# EAGLE design pcb_business_card (EAGLE 7.2.0)
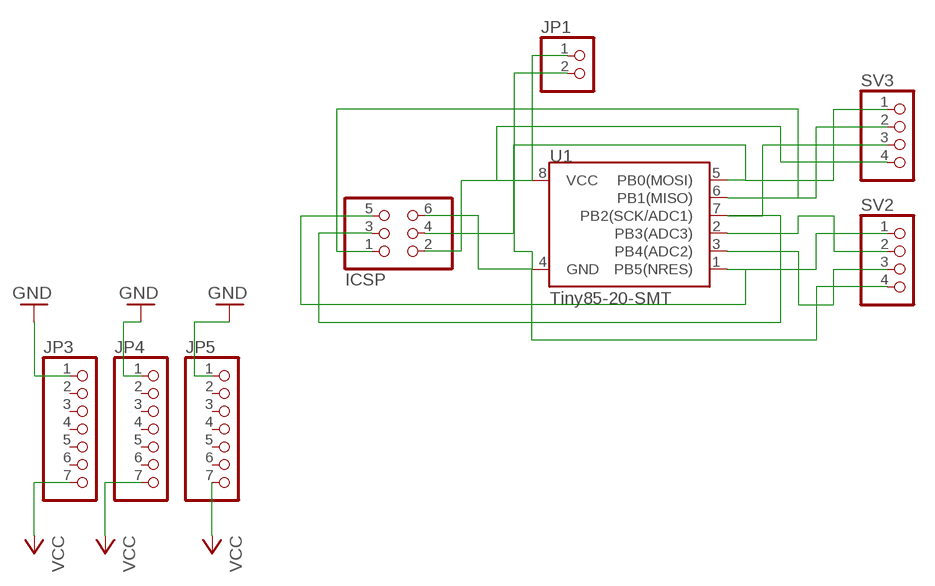
[diagram p0: schematic, sheet 1]

## Parts
ICSP  PINHD-2X3  [2X03]
JP1  PINHD-1X2  [1X02]
JP3  PINHD-1X7  [1X07]
JP4  PINHD-1X7  [1X07]
JP5  PINHD-1X7  [1X07]
SV2  PINHD-1X4  [1X04]
SV3  PINHD-1X4  [1X04]
U1  Tiny85-20-SMT  ATTINY45TINY85-20-SMT  [SO08-EIAJ]

## Nets
GND: ICSP.6 JP1.2 JP3.1 JP4.1 JP5.1 SV2.4 U1.4(GND)
MISO: ICSP.1 SV3.2 U1.6(PB1(MISO))
MOSI: ICSP.4 SV3.1 U1.5(PB0(MOSI))
N$8: SV2.3 U1.3(PB4(ADC2))
N$9: SV2.2 U1.2(PB3(ADC3))
RESET: ICSP.5 SV2.1 U1.1(PB5(NRES))
SCK: ICSP.3 SV3.3 U1.7(PB2(SCK/ADC1))
VCC: ICSP.2 JP1.1 JP3.7 JP4.7 JP5.7 SV3.4 U1.8(VCC)
Unconnected: JP3.2 JP3.3 JP3.4 JP3.5 JP3.6 JP4.2 JP4.3 JP4.4 JP4.5 JP4.6 JP5.2 JP5.3 JP5.4 JP5.5 JP5.6

## Library data of the parts
ICSP = pinhead:PINHD-2X3: PIN HEADER
JP1 = pinhead:PINHD-1X2: PIN HEADER
JP3-JP5 = pinhead:PINHD-1X7: PIN HEADER
SV2 SV3 = pinhead:PINHD-1X4: PIN HEADER
U1 = SparkFun-DigitalIC:ATTINY45: Atmel 8-pin 2/4/8kB flash uC; PROD_ID: IC-09092

## Board
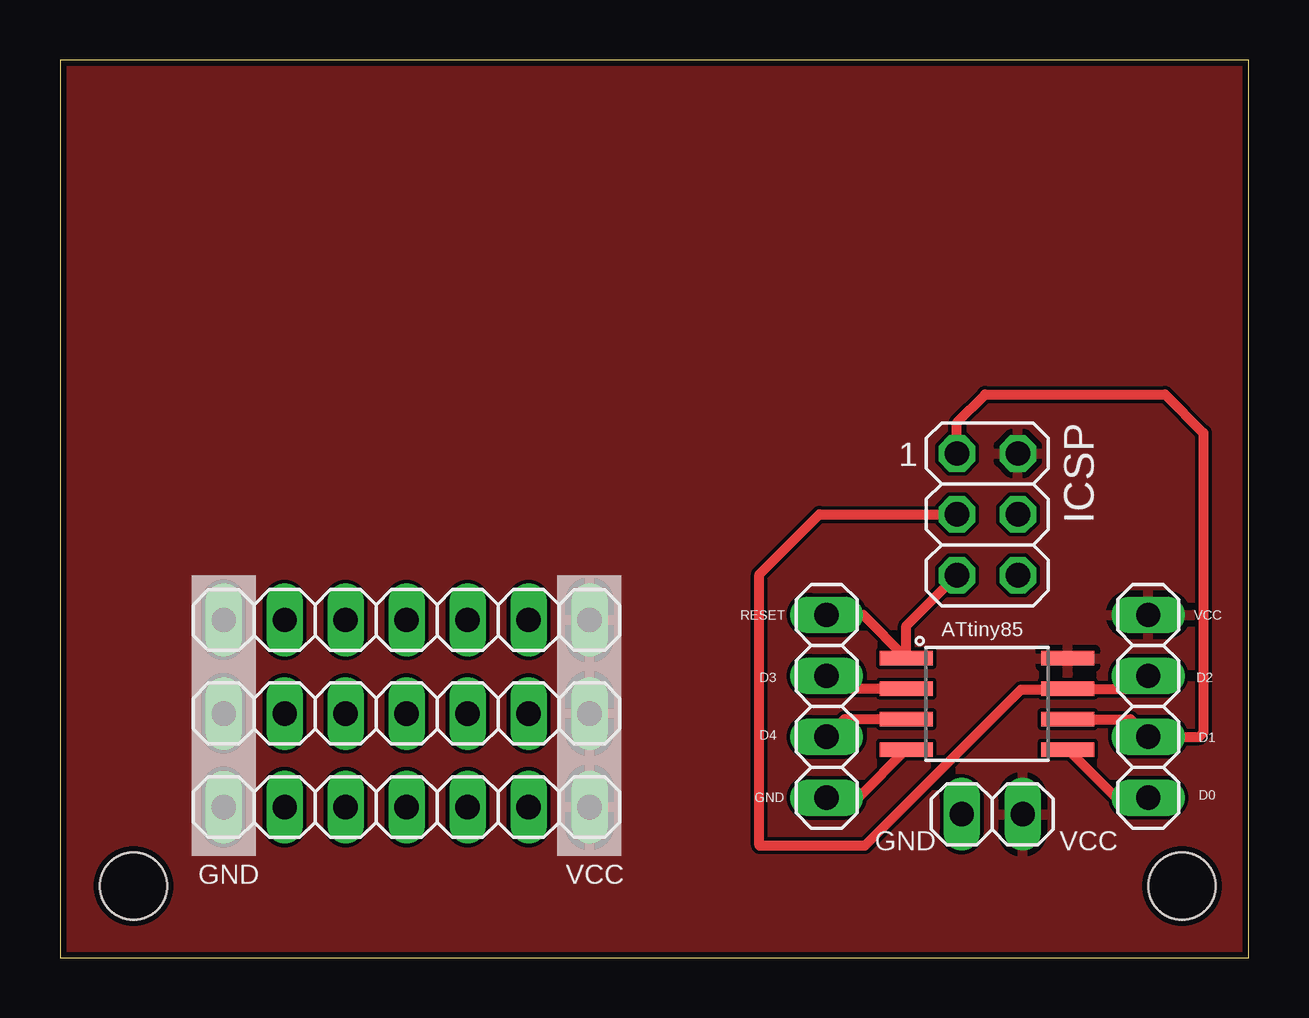
[diagram p1: board, top side]
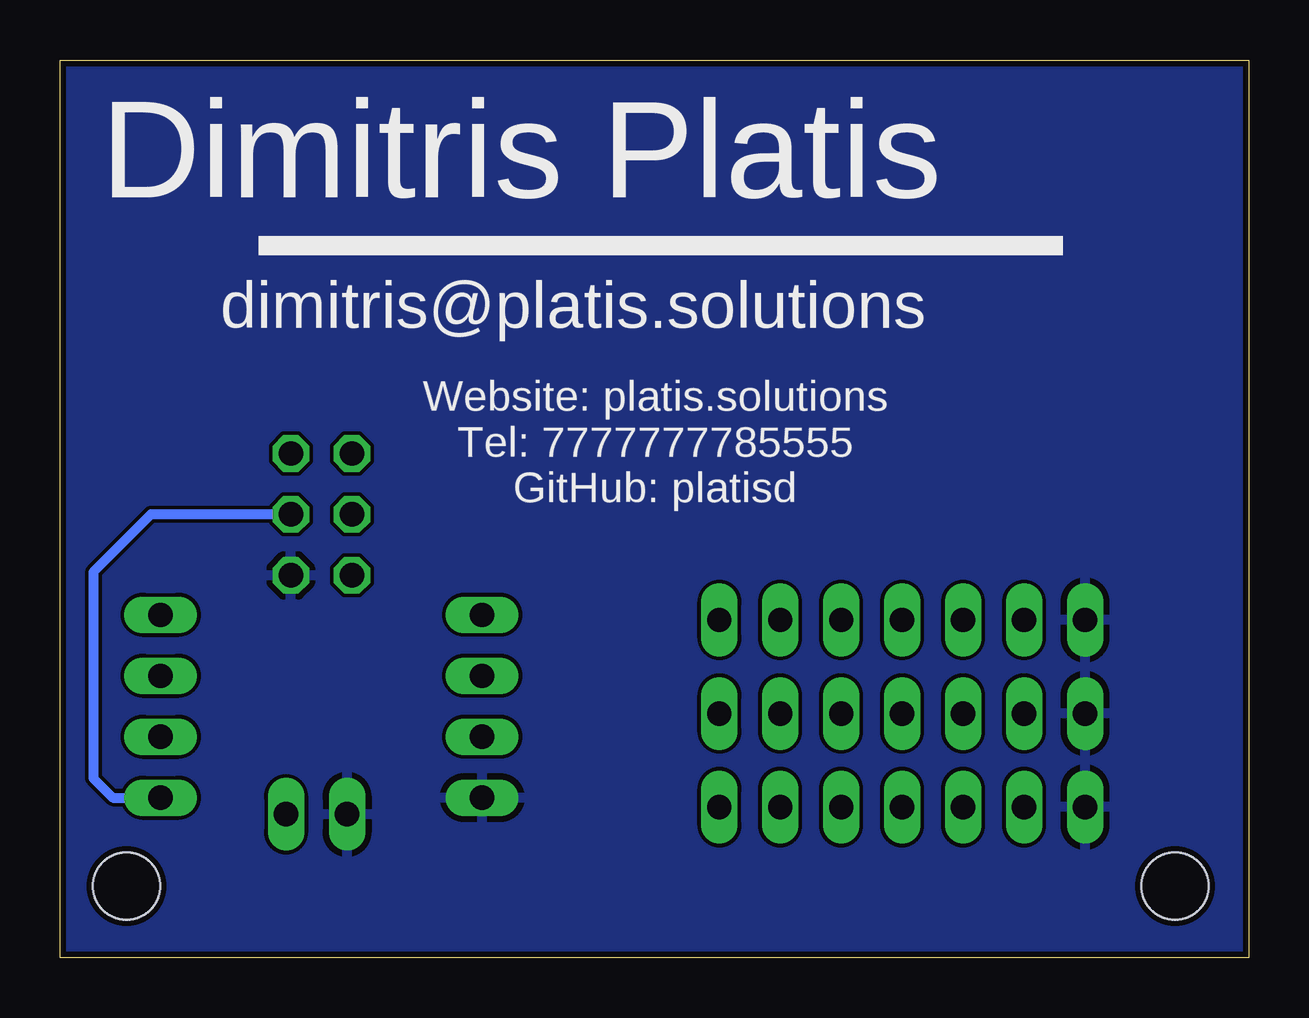
[diagram p2: board, bottom side, seen from below]

Size 49.53 x 37.42 mm. Coordinates in mm from the lower left corner, seen from the top.
Outline: 0,0 49.53,0 49.53,37.42 0,37.42 0,0
Copper layers (1*16): Top 0.035mm / dielectric 1.5mm / Bottom 0.035mm
Design rules "SeeedStudio_2layer_DRU_no_angle_20140221": minimum track width 6mil, minimum drill 12mil, track to track 6mil, track to pad 6mil, pad to pad 6mil, via to via 6mil, smd to smd 0mil, copper to edge 10mil, drill to drill 10mil, minimum pad ring 10mil, minimum via ring 6mil, stop-mask expansion 2mil, vias tented up to drill 100mil, thermal gap 10mil
Holes 2.8 mm at 3.07,2.98 46.75,2.98

### Footprints (pad centres in the part's own frame; a part is rotated, then mirrored left to right if it is on the bottom)
2X03 = drill 1.016 octagon: 1 -2.54,-1.27; 2 -2.54,1.27; 3 0,-1.27; 4 0,1.27; 5 2.54,-1.27; 6 2.54,1.27
1X02 = drill 1.016 long: 1 -1.27,0; 2 1.27,0
1X07 = drill 1.016 long: 1 -7.62,0; 2 -5.08,0; 3 -2.54,0; 4 0,0; 5 2.54,0; 6 5.08,0; 7 7.62,0
1X04 = drill 1.016 long: 1 -3.81,0; 2 -1.27,0; 3 1.27,0; 4 3.81,0
SO08-EIAJ = smd 0.61 x 2.21: 1 -1.905,-3.378; 2 -0.635,-3.378; 3 0.635,-3.378; 4 1.905,-3.378; 5 1.905,3.353; 6 0.635,3.353; 7 -0.635,3.353; 8 -1.905,3.353

### Placement (x,y rotation side)
ICSP  38.64,18.48 270 top
JP1  38.84,5.98 180 top
JP3  14.44,14.08 0 top
JP4  14.44,10.18 0 top
JP5  14.44,6.28 0 top
SV2  31.94,10.48 270 top
SV3  45.34,10.48 90 top
U1  38.64,10.58 270 top

### Tracks (layer width: path | path; a pad name or v marks a point on that pad's centre or on a via)
GND
  Top 0.406: U1.4 33.26,6.67 SV2.4
  pour Bottom: 0.04,37.38 49.54,37.38 49.54,-0.03 0.04,-0.03
MISO
  Top 0.406: ICSP.1 37.37,22.31 38.54,23.48 46.04,23.48 47.64,21.88 47.64,9.38 47.47,9.21 SV3.2 44.61,9.94 U1.6
MOSI
  Top 0.406: U1.5 44,6.67 SV3.1
  Bottom 0.406: ICSP.4 45.74,18.48 48.14,16.08 48.14,7.48 47.33,6.67 SV3.1
N$8
  Top 0.406: U1.3 32.68,9.94 SV2.3
N$9
  Top 0.406: U1.2 32.48,11.21 SV2.2
RESET
  Top 0.406: SV2.1 33.46,14.29 U1.1 35.26,13.83 ICSP.5
SCK
  Top 0.406: ICSP.3 31.64,18.48 29.14,15.98 29.14,4.68 33.54,4.68 40.04,11.18 41.96,11.18 U1.7 44.81,11.21 SV3.3
VCC
  pour Top: 0.15,37.4 49.55,37.4 49.55,0.06 0.02,0.06 0.02,37.4

### Text on the board
tPlace: 1 | RESET | ATtiny85 | VCC | D3 | D2 | D4 | D1 | GND | D0 | GND | VCC | GND | VCC
bPlace: Dimitris Platis | dimitris@platis.solutions | Website: platis.solutions / Tel: 7777777785555 / GitHub: platisd
tStop: Dimitris Platis | dimitris@platis.solutions